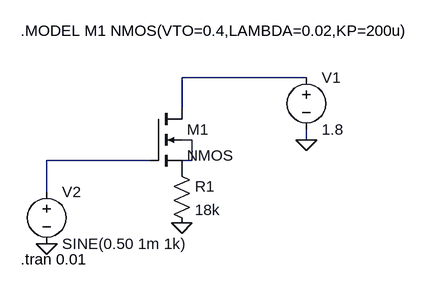
[diagram p0: schematic nmos.asc]
nmos.asc, the LTspice schematic file:
Version 4.1
SHEET 1 880 680
WIRE 384 64 192 64
WIRE 192 112 192 64
WIRE 208 160 192 160
WIRE 384 160 384 144
WIRE 144 192 -16 192
WIRE 208 192 208 160
WIRE 208 192 192 192
WIRE -16 240 -16 192
FLAG 192 288 0
FLAG -16 320 0
FLAG 384 160 0
SYMBOL nmos4 144 112 R0
SYMATTR InstName M1
SYMATTR Value2 l=1u w=350u
SYMBOL res 176 192 R0
SYMATTR InstName R1
SYMATTR Value 18k
SYMBOL voltage 384 48 R0
SYMATTR InstName V1
SYMATTR Value 1.8
SYMBOL voltage -16 224 R0
WINDOW 123 0 0 Left 0
WINDOW 39 0 0 Left 0
SYMATTR InstName V2
SYMATTR Value SINE(0.50 1m 1k)
TEXT -56 -8 Left 2 !.MODEL M1 NMOS(VTO=0.4,LAMBDA=0.02,KP=200u)
TEXT -56 344 Left 2 !.tran 0.01

The netlist it stands for:
* nmos.asc
M1 N001 N003 P001 N002 NMOS l=1u w=350u
R1 P001 0 18k
V1 N001 0 1.8
V2 N003 0 SINE(0.50 1m 1k)
.model NMOS NMOS
.model PMOS PMOS
.lib standard.mos
.MODEL M1 NMOS(VTO=0.4,LAMBDA=0.02,KP=200u)
.tran 0.01
.backanno
.end